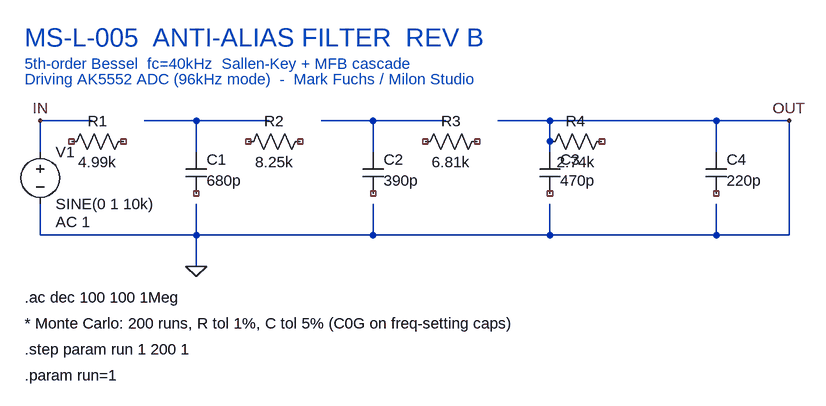
[diagram p0: schematic MS-L-005_anti_alias_filter.asc]
MS-L-005_anti_alias_filter.asc, the LTspice schematic file:
Version 4
SHEET 1 1640 680
WIRE -16 -32 -96 -32
WIRE 144 -32 64 -32
WIRE 256 -32 144 -32
WIRE 416 -32 336 -32
WIRE 528 -32 416 -32
WIRE 688 -32 608 -32
WIRE 800 -32 688 -32
WIRE 944 -32 800 -32
WIRE 1056 -32 944 -32
WIRE -96 16 -96 -32
WIRE 144 16 144 -32
WIRE 416 16 416 -32
WIRE 688 16 688 -32
WIRE 944 16 944 -32
WIRE -96 144 -96 96
WIRE 144 144 144 96
WIRE 144 144 -96 144
WIRE 416 144 416 96
WIRE 416 144 144 144
WIRE 688 144 688 96
WIRE 688 144 416 144
WIRE 944 144 944 96
WIRE 944 144 688 144
WIRE 1056 144 1056 -32
WIRE 1056 144 944 144
WIRE 144 192 144 144
FLAG 144 192 0
FLAG -96 -32 IN
FLAG 1056 -32 OUT
SYMBOL voltage -96 0 R0
WINDOW 123 24 124 Left 2
WINDOW 39 0 0 Left 0
SYMATTR Value SINE(0 1 10k)
SYMATTR Value2 AC 1
SYMATTR InstName V1
SYMBOL res 48 -16 R90
WINDOW 0 0 56 VBottom 2
WINDOW 3 32 56 VTop 2
SYMATTR InstName R1
SYMATTR Value 4.99k
SYMBOL res 320 -16 R90
WINDOW 0 0 56 VBottom 2
WINDOW 3 32 56 VTop 2
SYMATTR InstName R2
SYMATTR Value 8.25k
SYMBOL res 592 -16 R90
WINDOW 0 0 56 VBottom 2
WINDOW 3 32 56 VTop 2
SYMATTR InstName R3
SYMATTR Value 6.81k
SYMBOL res 784 -16 R90
WINDOW 0 0 56 VBottom 2
WINDOW 3 32 56 VTop 2
SYMATTR InstName R4
SYMATTR Value 2.74k
SYMBOL cap 128 16 R0
WINDOW 0 32 12 Left 2
WINDOW 3 32 44 Left 2
SYMATTR InstName C1
SYMATTR Value 680p
SYMBOL cap 400 16 R0
WINDOW 0 32 12 Left 2
WINDOW 3 32 44 Left 2
SYMATTR InstName C2
SYMATTR Value 390p
SYMBOL cap 672 16 R0
WINDOW 0 32 12 Left 2
WINDOW 3 32 44 Left 2
SYMATTR InstName C3
SYMATTR Value 470p
SYMBOL cap 928 16 R0
WINDOW 0 32 12 Left 2
WINDOW 3 32 44 Left 2
SYMATTR InstName C4
SYMATTR Value 220p
TEXT -120 -160 Left 4 ;MS-L-005  ANTI-ALIAS FILTER  REV B
TEXT -120 -120 Left 2 ;5th-order Bessel  fc=40kHz  Sallen-Key + MFB cascade
TEXT -120 -96 Left 2 ;Driving AK5552 ADC (96kHz mode)  -  Mark Fuchs / Milon Studio
TEXT -120 240 Left 2 !.ac dec 100 100 1Meg
TEXT -120 280 Left 2 !* Monte Carlo: 200 runs, R tol 1%, C tol 5% (C0G on freq-setting caps)
TEXT -120 320 Left 2 !.step param run 1 200 1
TEXT -120 360 Left 2 !.param run=1

The netlist it stands for:
* MS-L-005_anti_alias_filter.asc
V1 IN 0 SINE(0 1 10k) AC 1
R1 NC_01 NC_02 4.99k
R2 NC_03 NC_04 8.25k
R3 NC_05 NC_06 6.81k
R4 NC_07 0 2.74k
C1 N001 NC_08 680p
C2 N002 NC_09 390p
C3 0 NC_10 470p
C4 0 NC_11 220p
* MS-L-005  ANTI-ALIAS FILTER  REV B
* 5th-order Bessel  fc=40kHz  Sallen-Key + MFB cascade
* Driving AK5552 ADC (96kHz mode)  -  Mark Fuchs / Milon Studio
.ac dec 100 100 1Meg
* Monte Carlo: 200 runs, R tol 1%, C tol 5% (C0G on freq-setting caps)
.step param run 1 200 1
.param run=1
.backanno
.end